# Altium schematic sheet MacroPad_schematics.SchDoc
size A2; SheetNumber: 1; SheetTotal: 1
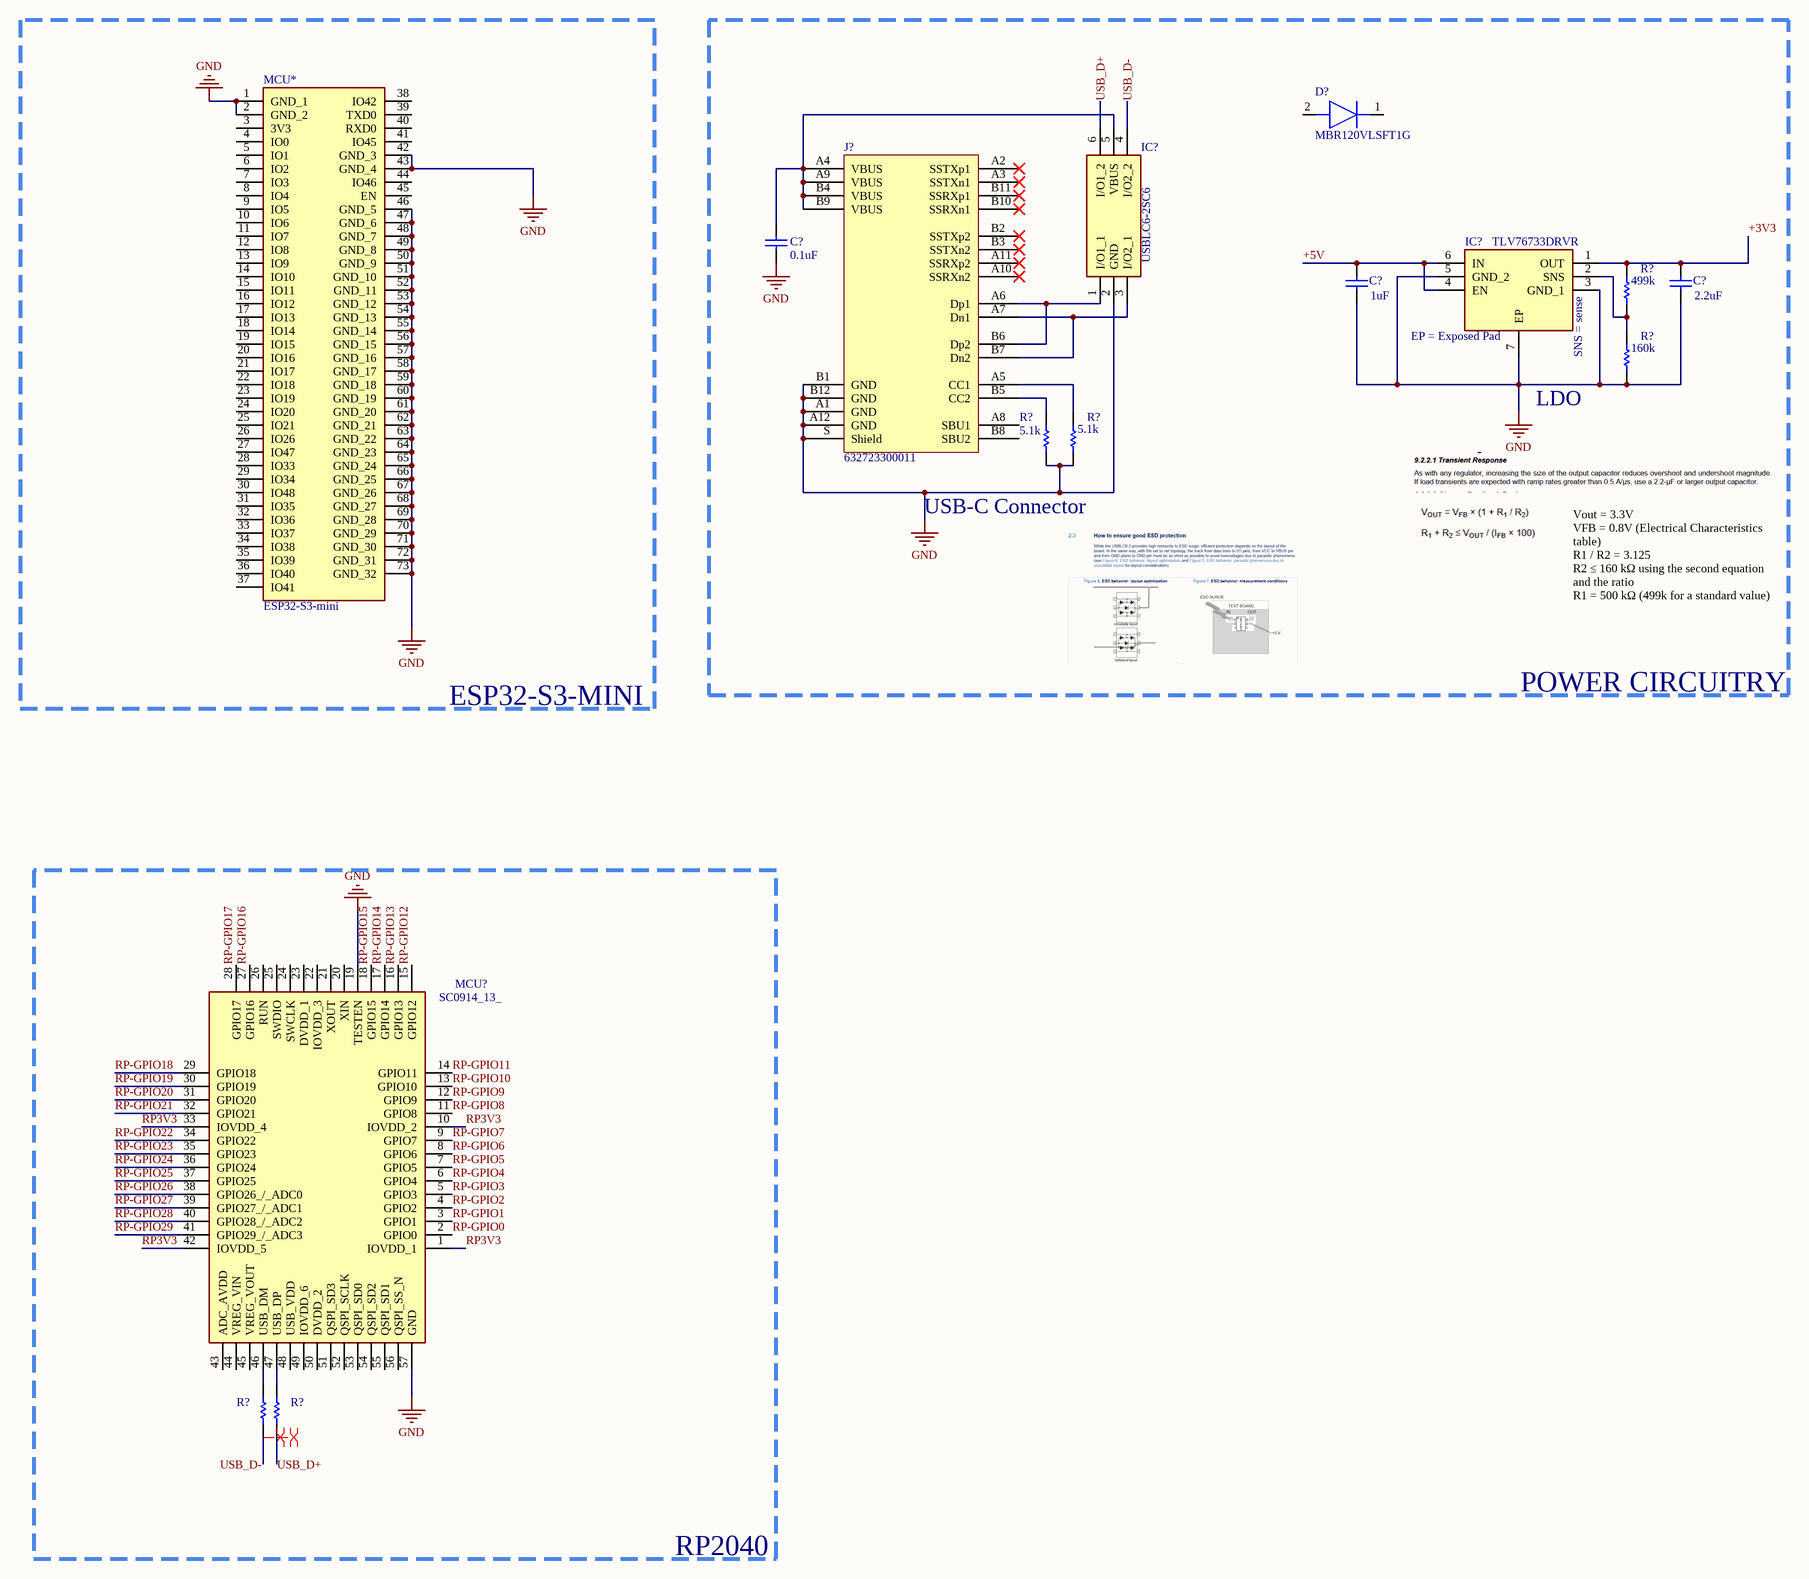
[diagram p0: MacroPad_schematics.SchDoc]

## Parts
(Parts that share a designator on the sheet are numbered #1, #2 ... from top to bottom, then left to right.)
C?#1  value 0.1uF  [KEMT-1206-2_L]  (hidden comment: 1206 Capacitor)
C?#2  value 1uF  [KEMT-1206-2_L]  (hidden comment: 1206 Capacitor)
C?#3  value 2.2uF  [KEMT-1206-2_L]  (hidden comment: 1206 Capacitor)
D?  MBR120VLSFT1G  [SODFL3616X98N]
IC?#1  TLV76733DRVR  [SON65P200X200X80-7N]
IC?#2  USBLC6-2SC6  [SOT95P280X145-6N]
J?  632723300011  [WURTH 632723300011]
MCU*  ESP32-S3-mini  [ESP32S3MINI1N8]
MCU?  SC0914_13_  [SC091413]
R?#1  value 499k  [RESC1005X40X25ML05T05]  (hidden comment: 0402 Resistor)
R?#2  value 160k  [RESC1005X40X25ML05T05]  (hidden comment: 0402 Resistor)
R?#3  value 5.1k  [RESC1005X40X25ML05T05]  (hidden comment: 0402 Resistor)
R?#4  value 5.1k  [RESC1005X40X25ML05T05]  (hidden comment: 0402 Resistor)
R?#5  0402 Resistor  [RESC1005X40X25ML05T05]  (value not drawn)
R?#6  0402 Resistor  [RESC1005X40X25ML05T05]  (value not drawn)

## Blocks framed on the sheet
ESP32-S3-MINI: MCU*
POWER CIRCUITRY: C?#1-C?#3 D? IC?#1 IC?#2 J? R?#1-R?#4
RP2040: MCU? R?#5 R?#6

## Nets
GND: C?#1.2 C?#2.2 C?#3.2 IC?#1.3(GND_1) IC?#1.5(GND_2) IC?#1.7(EP) IC?#2.2(GND) J?.A1(GND) J?.A12(GND) J?.B1(GND) J?.B12(GND) J?.S(Shield) MCU*.1(GND_1) MCU*.2(GND_2) MCU*.42(GND_3) MCU*.43(GND_4) MCU*.46(GND_5) MCU*.47(GND_6) MCU*.48(GND_7) MCU*.49(GND_8) MCU*.50(GND_9) MCU*.51(GND_10) MCU*.52(GND_11) MCU*.53(GND_12) MCU*.54(GND_13) MCU*.55(GND_14) MCU*.56(GND_15) MCU*.57(GND_16) MCU*.58(GND_17) MCU*.59(GND_18) MCU*.60(GND_19) MCU*.61(GND_20) MCU*.62(GND_21) MCU*.63(GND_22) MCU*.64(GND_23) MCU*.65(GND_24) MCU*.66(GND_25) MCU*.67(GND_26) MCU*.68(GND_27) MCU*.69(GND_28) MCU*.70(GND_29) MCU*.71(GND_30) MCU*.72(GND_31) MCU*.73(GND_32) MCU?.19(TESTEN) MCU?.57(GND) R?#2.1 R?#3.1 R?#4.1
+3V3: C?#3.1 IC?#1.1(OUT) R?#1.2
+5V: C?#2.1 IC?#1.4(EN) IC?#1.6(IN)
RP3V3: MCU?.1(IOVDD_1) MCU?.10(IOVDD_2) MCU?.33(IOVDD_4) MCU?.42(IOVDD_5)
RP-GPIO0: MCU?.2(GPIO0)
RP-GPIO1: MCU?.3(GPIO1)
RP-GPIO2: MCU?.4(GPIO2)
RP-GPIO3: MCU?.5(GPIO3)
RP-GPIO4: MCU?.6(GPIO4)
RP-GPIO5: MCU?.7(GPIO5)
RP-GPIO6: MCU?.8(GPIO6)
RP-GPIO7: MCU?.9(GPIO7)
RP-GPIO8: MCU?.11(GPIO8)
RP-GPIO9: MCU?.12(GPIO9)
RP-GPIO10: MCU?.13(GPIO10)
RP-GPIO11: MCU?.14(GPIO11)
RP-GPIO12: MCU?.15(GPIO12)
RP-GPIO13: MCU?.16(GPIO13)
RP-GPIO14: MCU?.17(GPIO14)
RP-GPIO15: MCU?.18(GPIO15)
RP-GPIO16: MCU?.27(GPIO16)
RP-GPIO17: MCU?.28(GPIO17)
RP-GPIO18: MCU?.29(GPIO18)
RP-GPIO19: MCU?.30(GPIO19)
RP-GPIO20: MCU?.31(GPIO20)
RP-GPIO21: MCU?.32(GPIO21)
RP-GPIO22: MCU?.34(GPIO22)
RP-GPIO23: MCU?.35(GPIO23)
RP-GPIO24: MCU?.36(GPIO24)
RP-GPIO25: MCU?.37(GPIO25)
RP-GPIO26: MCU?.38(GPIO26_/_ADC0)
RP-GPIO27: MCU?.39(GPIO27_/_ADC1)
RP-GPIO28: MCU?.40(GPIO28_/_ADC2)
RP-GPIO29: MCU?.41(GPIO29_/_ADC3)
USB_D+: IC?#2.6(I/O1_2) R?#6.1
USB_D-: IC?#2.4(I/O2_2) R?#5.1
NetC?#1_1: C?#1.1 IC?#2.5(VBUS) J?.A4(VBUS) J?.A9(VBUS) J?.B4(VBUS) J?.B9(VBUS)
NetIC?#1_2: IC?#1.2(SNS) R?#1.1 R?#2.2
NetIC?#2_1: IC?#2.1(I/O1_1) J?.A6(Dp1) J?.B6(Dp2)
NetIC?#2_3: IC?#2.3(I/O2_1) J?.A7(Dn1) J?.B7(Dn2)
NetJ?_A5: J?.A5(CC1) R?#4.2
NetJ?_B5: J?.B5(CC2) R?#3.2
NetMCU?_46: MCU?.46(USB_DM) R?#5.2
NetMCU?_47: MCU?.47(USB_DP) R?#6.2

Not connected (* = marked no-connect by the designer): D? 1(K) 2(A); J? A2(SSTXp1)* A3(SSTXn1)* A8(SBU1) A10(SSRXn2)* A11(SSRXp2)* B2(SSTXp2)* B3(SSTXn2)* B8(SBU2) B10(SSRXn1)* B11(SSRXp1)*; MCU* 3(3V3) 4(IO0) 5(IO1) 6(IO2) 7(IO3) 8(IO4) 9(IO5) 10(IO6) 11(IO7) 12(IO8) 13(IO9) 14(IO10) 15(IO11) 16(IO12) 17(IO13) 18(IO14) 19(IO15) 20(IO16) 21(IO17) 22(IO18) 23(IO19) 24(IO20) 25(IO21) 26(IO26) 27(IO47) 28(IO33) 29(IO34) 30(IO48) 31(IO35) 32(IO36) 33(IO37) 34(IO38) 35(IO39) 36(IO40) 37(IO41) 38(IO42) 39(TXD0) 40(RXD0) 41(IO45) 44(IO46) 45(EN); MCU? 20(XIN) 21(XOUT) 22(IOVDD_3) 23(DVDD_1) 24(SWCLK) 25(SWDIO) 26(RUN) 43(ADC_AVDD) 44(VREG_VIN) 45(VREG_VOUT) 48(USB_VDD) 49(IOVDD_6) 50(DVDD_2) 51(QSPI_SD3) 52(QSPI_SCLK) 53(QSPI_SD0) 54(QSPI_SD2) 55(QSPI_SD1) 56(QSPI_SS_N)

## Layout directives
differential pair: USB_D+, USB_D-

## Notes on the sheet
- (near IC?#1) EP = Exposed Pad
- LDO
- (near IC?#1) SNS = sense
- (near R?#3) USB-C Connector
- Vout = 3.3V
  VFB = 0.8V (Electrical Characteristics table)
  R1 / R2 = 3.125
  R2 ≤ 160 kΩ using the second equation and the ratio
  R1 = 500 kΩ (499k for a standard value)

## Library data of the parts
C?#1-C?#3 = CMP-001-00000-5: General Purpose Capacitor; Tolerance: 10%; Capacitor Type: Ceramic; Voltage Rating: 50V; Max Operating Temperature: 125°C; RoHS Compliant: Yes; Min Operating Temperature: -55°C; Case/Package: 1206
D? = MBR120VLSFT1G: Diode; Manufacturer_Name: onsemi; Datasheet Link: https://www.onsemi.com/pub/Collateral/MBR120VLSFT1-D.PDF; Height: 0.98mm; Manufacturer_Part_Number: MBR120VLSFT1G; Mouser Part Number: 863-MBR120VLSFT1G; Mouser Price/Stock: https://www.mouser.co.uk/ProductDetail/onsemi/MBR120VLSFT1G?qs=3JMERSakebpX%252BkItPpFCkg%3D%3D; Arrow Part Number: MBR120VLSFT1G; Arrow Price/Stock: https://www.arrow.com/en/products/mbr120vlsft1g/on-semiconductor?utm_currency=USD&region=nac
IC?#1 = TLV76733DRVR: Integrated Circuit; Manufacturer_Name: Texas Instruments; Datasheet Link: http://www.ti.com/lit/gpn/TLV767; Height: 0.8mm; Manufacturer_Part_Number: TLV76733DRVR; Mouser Part Number: 595-TLV76733DRVR; Mouser Price/Stock: https://www.mouser.co.uk/ProductDetail/Texas-Instruments/TLV76733DRVR?qs=9r4v7xj2LnmGIkwTuPlHig%3D%3D; Arrow Part Number: TLV76733DRVR; Arrow Price/Stock: https://www.arrow.com/en/products/tlv76733drvr/texas-instruments?utm_currency=USD&region=europe
IC?#2 = USBLC6-2SC6: Integrated Circuit; Manufacturer_Name: STMicroelectronics; Datasheet Link: http://www.st.com/st-web-ui/static/active/en/resource/technical/document/datasheet/CD00050750.pdf; Height: 1.45mm; Manufacturer_Part_Number: USBLC6-2SC6; Mouser Part Number: 511-USBLC6-2SC6; Mouser Price/Stock: https://www.mouser.co.uk/ProductDetail/STMicroelectronics/USBLC6-2SC6?qs=po45yt2pPpu%2FhNIlwQdTlg%3D%3D; Arrow Part Number: USBLC6-2SC6; Arrow Price/Stock: https://www.arrow.com/en/products/usblc6-2sc6/stmicroelectronics?utm_currency=USD&region=europe
J? = 632723300011: CONN RCP USB3.1 TYPEC 24P SMD RA; Manufacturer: Würth Elektronik; Connector Type: USB - C (Type - C); Current Rating (Amps): 5A; Gender: Receptacle; Mating Cycles: 10000; Number of Contacts: 24; Number of Ports: 1; Shielding: Unshielded; Specifications: USB 3.1 (USB 3.1 Gen 2, Superspeed+); Voltage - Rated: 20VDC; Part Number: 632723300011; ComponentLink1Description: Datasheet; ComponentLink1URL: https://katalog.we-online.de/em/datasheet/632723x00011.pdf; ComponentLink2Description: DigiKey Link; ComponentLink2URL: http://digikey.com/product-detail/en/w-rth-elektronik/632723300011/732-9618-1-ND/5806673; LastUpdated: 24/05/2020 22:36:40; Lifecycle Status: Active; Minimum Order: 1; Mounting Feature: Horizontal; Mounting Type: Surface Mount, Right Angle; Through Hole; Operating Temperature: -40°C ~ 105°C; Packaging: TapeAndReel; Part Status: Active; Price: 2.95; Series: WR-COM; Supplier 1: DigiKey; Supplier Part Number 1: 732-9618-1-ND; Termination: Solder
MCU* = CMP-120-000000-1: Source: MacroPad_schematicsLibrary.SchLib; Design Item ID: ESP32-S3-mini
MCU? = SC0914_13_: ARM mcu; Manufacturer_Name: RASPBERRY-PI; Manufacturer_Part_Number: SC0914(13); Datasheet Link: https://datasheets.raspberrypi.com/rp2040/rp2040-datasheet.pdf; Height: 0.9mm; Mouser Part Number: 358-SC091413; Mouser Price/Stock: https://www.mouser.co.uk/ProductDetail/Raspberry-Pi/SC091413?qs=T%252BzbugeAwjhr%252BUbBr3TJcw%3D%3D
R?#1-R?#6 = CMP-009-00003-5: General Purpose 0402 Resistor; Rated Temperature: 70°C; Rated Power Dissipation (P): 100mW; Tolerance: 1%; Reference Standard: AEC-Q200; Package Height: 0.35mm; Package Width: 0.5mm; Temperature Coefficient: 100ppm/°C; Resistance: 100R; Working Voltage: 50V; Package Length: 1mm; Terminal Finish: Nickel; Package Shape: Rectangular; Construction: Rectangular; RoHS Compliant: Yes; REACH SVHC: Yes; Technology: METAL GLAZE/THICK FILM; Termination: Wraparound; Mount: Surface Mount; Min Operating Temperature: -55°C; Number of Pins: 2; Packaging: Tape and Reel; Package Style: SMTMeter; JESD-609 Code: e3; Size Code: 0402; Max Operating Temperature: 155°C; Resistor Type: FIXED RESISTOR